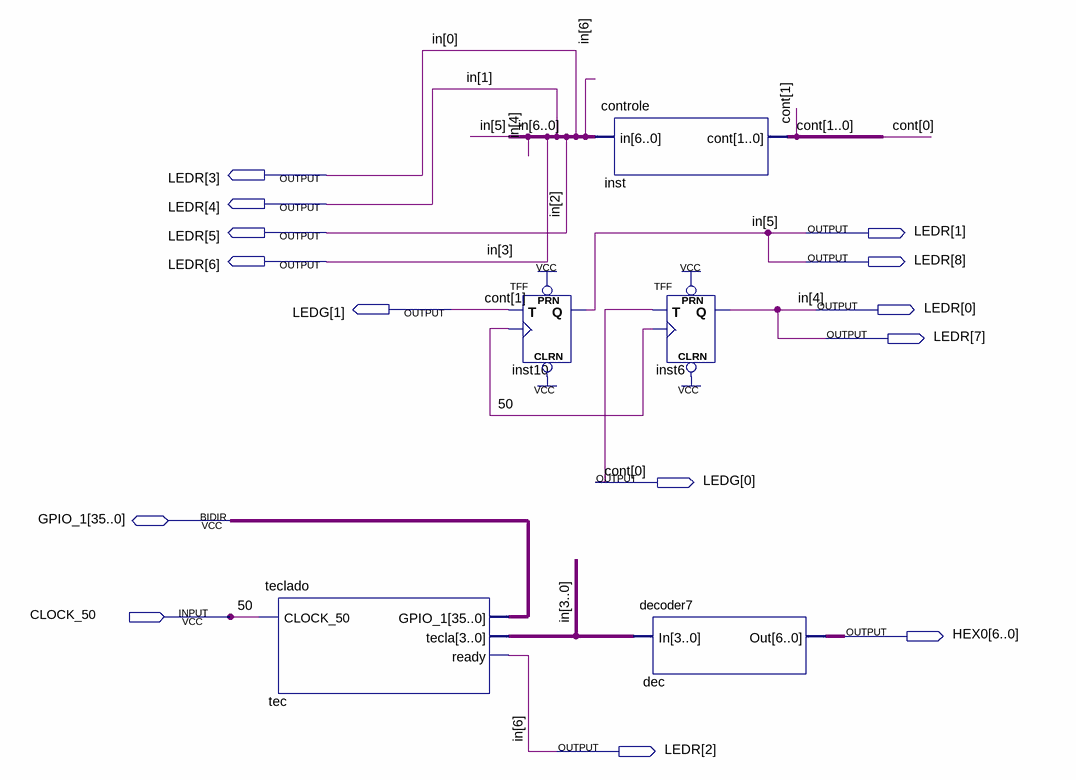
[diagram p0: schematic sheet]
// Quartus schematic TesteMaquinaDeEstados.bdf as structural Verilog: 5 symbols, 14 pins
module TesteMaquinaDeEstados (
  input  CLOCK_50,
  inout  [35:0] GPIO_1,
  output [8:0] LEDR,
  output [1:0] LEDG,
  output [6:0] HEX0
);

  teclado tec (.CLOCK_50(CLOCK_50), .tecla(LEDR[6:3]), .ready(LEDR[2]), .GPIO_1(GPIO_1));
  TFF inst10 (.PRN(1'b1), .CLRN(1'b1), .T(LEDG[1]), .CLK(CLOCK_50), .Q(LEDR[8]));
  controle inst (.in({LEDR[2], LEDR[8:3]}), .cont(LEDG));
  TFF inst6 (.PRN(1'b1), .CLRN(1'b1), .T(LEDG[0]), .CLK(CLOCK_50), .Q(LEDR[7]));
  decoder7 dec (.In(LEDR[6:3]), .Out(HEX0));

  assign LEDR[1:0] = LEDR[8:7];

  // Other names for the same wires on the sheet: 50 = CLOCK_50; cont[1:0] = LEDG; in[6:0] = {LEDR[2], LEDR[8:3]}
endmodule
